# Altium schematic sheet LED strip.SchDoc
size A4
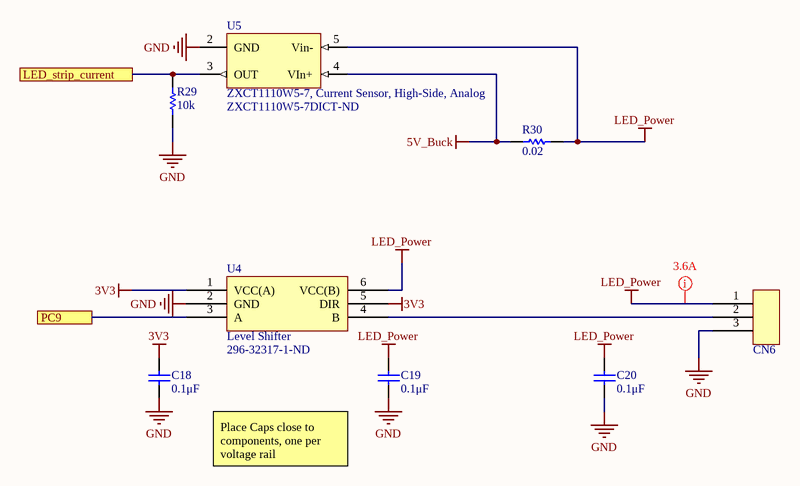
[diagram p0: LED strip.SchDoc]

## Parts
C18  0.1μF  [CAPC1608N(0603")]
C19  0.1μF  [CAPC1608N(0603")]
C20  0.1μF  [CAPC1608N(0603")]
CN6  B3PS-VH(LF)(SN)  [3X1 Male Header, Locking, 10A]  (value not drawn)
R29  10k  [RESC1608N(0603")]
R30  0.02  [RESC6332N(2512")]
U4  Level Shifter  Supplier Part Number 1: 296-32317-1-ND  [SOT-363]
U5  ZXCT1110W5-7, Current Sensor, High-Side, Analog  Supplier Part Number 1: ZXCT1110W5-7DICT-ND  [SOT23-5]

## Ports
LED_strip_current, PC9

## Nets
3V3: C18.1(Anode) U4.1(VCC(A)) U4.5(DIR)
5V_Buck: R30.1 U5.4(VIn+)
GND: C18.2(Cathode) C19.2(Cathode) C20.2(Cathode) CN6.3 R29.1 U4.2(GND) U5.2(GND)
LED_Power: C19.1(Anode) C20.1(Anode) CN6.1 R30.2 U4.6(VCC(B)) U5.5(Vin-)
LED_strip_current: R29.2 U5.3(OUT) ; port LED_strip_current
PC9: U4.3(A) ; port PC9
NetCN6_2: CN6.2 U4.4(B)

## Layout directives
mark named 3.6A: LED_Power

## Notes on the sheet
- Place Caps close to components, one per voltage rail

## Library data of the parts
C18-C20 = 0.1uF 16V 0603 SMD, Ceramic: Capacitor, Ceramic, 16V, +/- 10%, 0603 SMD, X7R; Published: 16-04-26; Publisher: AUVic; PackageDescription: Chip Capacitor; Value: 0.1μF; Created By: Andy Bates; Supplier 1: Digi-Key; Supplier Part Number 1: 1276-1005-1-ND
CN6 = 3x1 Male Header, Locking, 10A: CONN HEADER VH SIDE 3POS 3.96MM; Made by: Robert Keen; Made on: 2018-08-16; Supplier 1: Digi-Key; Supplier Part Number 1: 455-1649-ND; ComponentLink1Description: Digikey (male); ComponentLink1URL: https://www.digikey.ca/product-detail/en/jst-sales-america-inc/B3PS-VH-LF-SN/455-1649-ND/926556; ComponentLink2Description: Digikey (female); ComponentLink2URL: https://www.digikey.ca/product-detail/en/jst-sales-america-inc/VHR-3N/455-1184-ND/608625; ComponentLink3Description: Digikey (crimps); ComponentLink3URL: https://www.digikey.ca/product-detail/en/jst-sales-america-inc/SVH-21T-P1.1/455-1133-1-ND/527367; Supplier Part Number 2: 455-1184-ND; Supplier Part Number 3: 455-1133-1-ND
R29 = 10kR, 1%, 1/10W, 0603 SMD: Made By: Ashwin Sira; Owned By: AUVic; Created On: 14-05-31; Last Edited: 14-05-31; Supplier 1: Digi-Key; Supplier Part Number 1: 311-10.0KHRCT-ND; Value: 10k
R30 = 0R02, 1%, 2W, 2512 SMD: Created By: Robert Keen; Created On: 2018-08-16; ComponentLink1Description: Digikey; ComponentLink1URL: https://www.digikey.ca/product-detail/en/te-connectivity-passive-product/RLP73V3AR020FTDF/A109677CT-ND/4032443; Supplier 1: Digi-Key; Supplier Part Number 1: A109677CT-ND; Value: 0.02
U4 = Bidirectional Level Shifter, 1.65V - 5.5V VCCA, 1.65V - 5.5V VCCB: Voltage Level Translator Bidirectional 1 Circuit 1 Channel 420Mbps SC-88 (SOT-363); Made By: Andy Bates; Made on: 2018-08-16; ComponentLink1Description: Digikey; ComponentLink1URL: https://www.digikey.ca/product-detail/en/nxp-usa-inc/NTB0101AGWH/568-14541-1-ND/9449849; Supplier 1: Digi-Key
U5 = ZXCT1110W5-7, Current Sensor, High-Side, Analog: Diodes Incorporated, ZXCT1110W5-7; Created By: Jacob Lower; Publisher: AUVic; Created On: 2016-03-16; Supplier 1: Digi-Key